# EAGLE design motor_driver_ver4.0 (EAGLE 6.2)
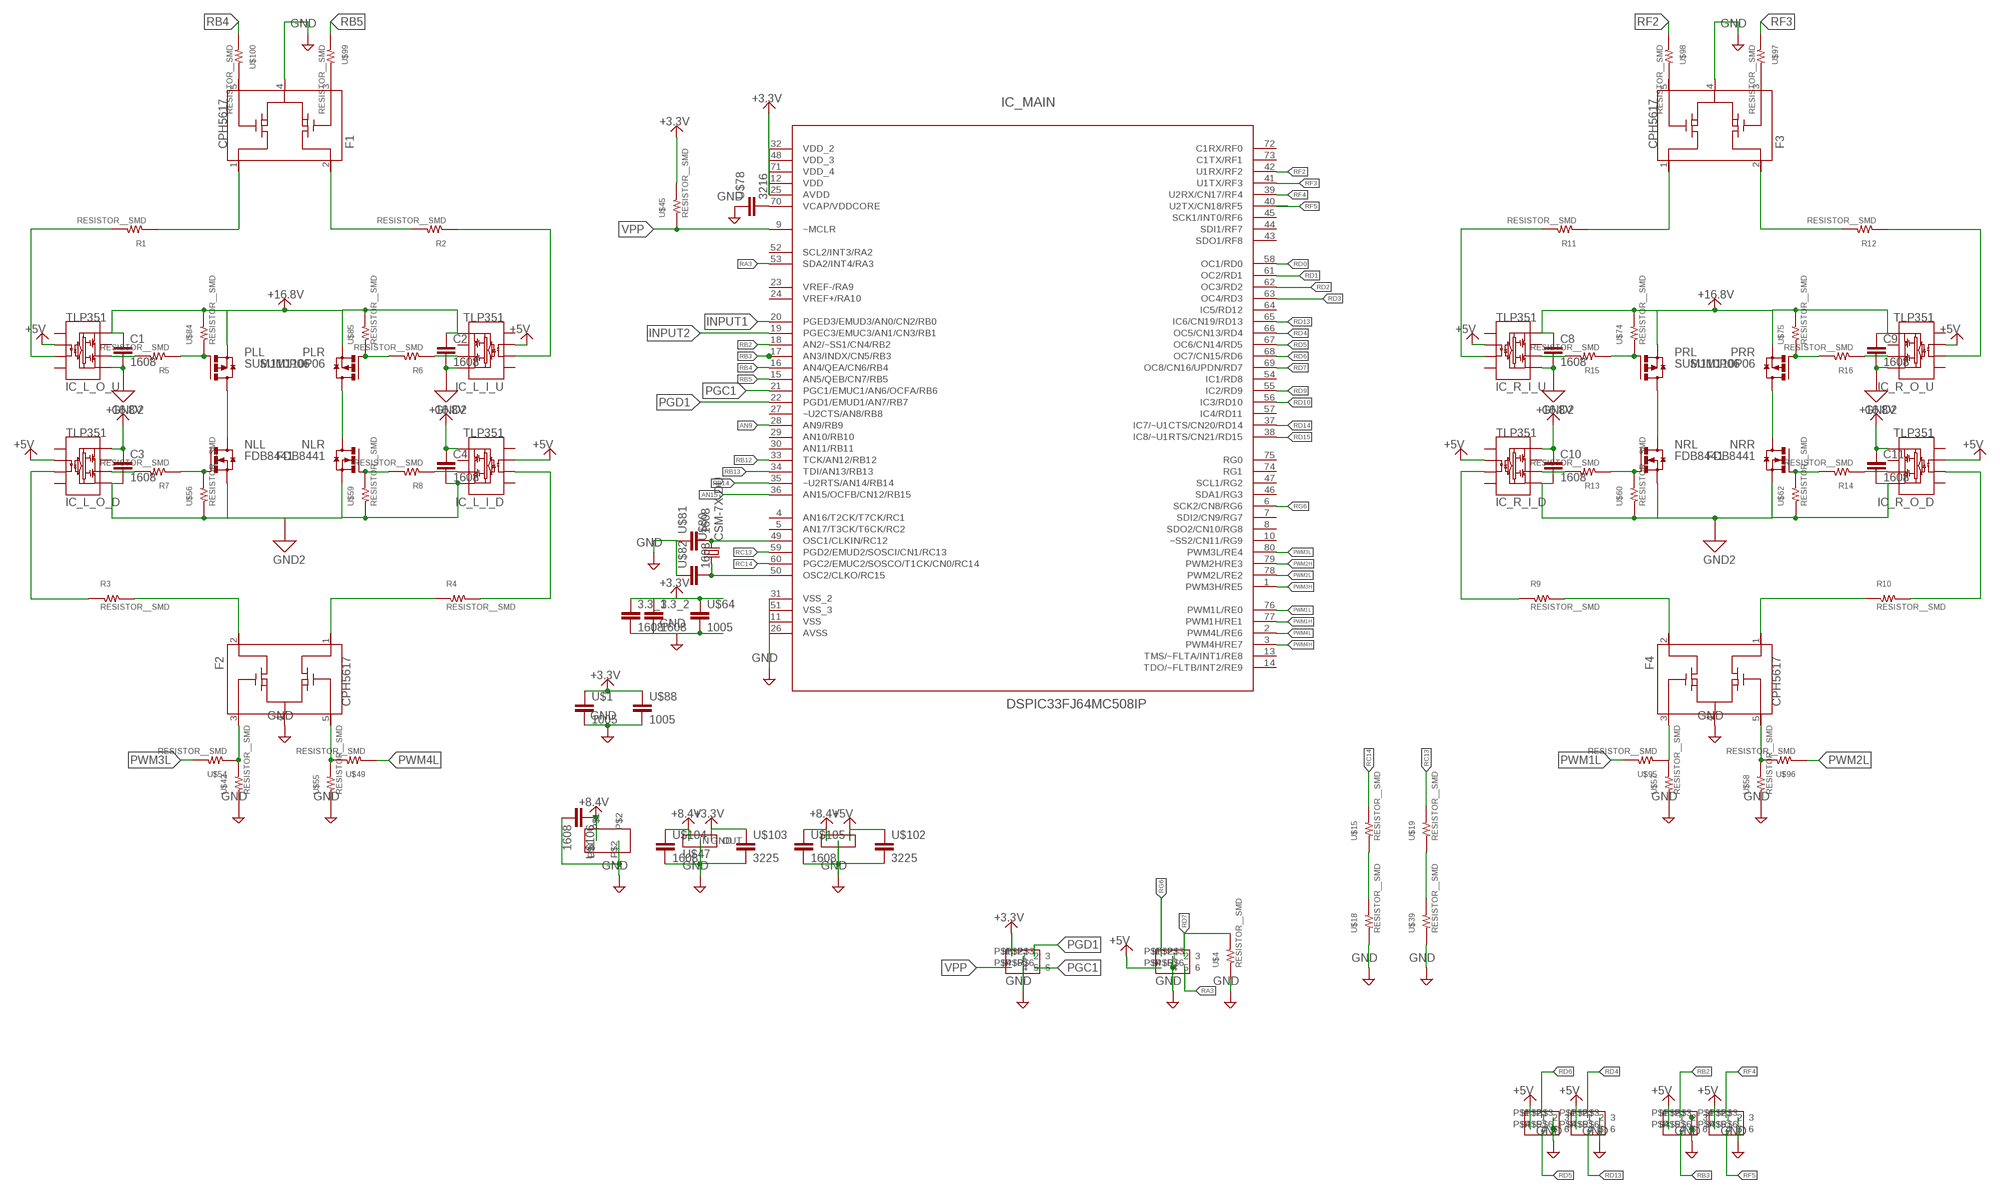
[diagram p0: schematic, sheet 1]

## Parts
3.3_1  1608  [1608]
3.3_2  1608  [1608]
C1  1608  [1608]
C2  1608  [1608]
C3  1608  [1608]
C4  1608  [1608]
C8  1608  [1608]
C9  1608  [1608]
C10  1608  [1608]
C11  1608  [1608]
F1  CPH5617  [CHP-5]
F2  CPH5617  [CHP-5]
F3  CPH5617  [CHP-5]
F4  CPH5617  [CHP-5]
IC_L_I_D  TLP351  [DIL08]
IC_L_I_U  TLP351  [DIL08]
IC_L_O_D  TLP351  [DIL08]
IC_L_O_U  TLP351  [DIL08]
IC_MAIN  DSPIC33FJ64MC508IP  [QFP50P1400X1400X120-80N]
IC_R_I_D  TLP351  [DIL08]
IC_R_I_U  TLP351  [DIL08]
IC_R_O_D  TLP351  [DIL08]
IC_R_O_U  TLP351  [DIL08]
NLL  FDB8441  [TO-263]
NLR  FDB8441  [TO-263]
NRL  FDB8441  [TO-263]
NRR  FDB8441  [TO-263]
PLL  SUM110P06  [TO-263]
PLR  SUM110P06  [TO-263]
PRL  SUM110P06  [TO-263]
PRR  SUM110P06  [TO-263]
R1  RESISTOR__SMD  [1608]
R2  RESISTOR__SMD  [1608]
R3  RESISTOR__SMD  [1608]
R4  RESISTOR__SMD  [1608]
R5  RESISTOR__SMD  [1608]
R6  RESISTOR__SMD  [1608]
R7  RESISTOR__SMD  [1608]
R8  RESISTOR__SMD  [1608]
R9  RESISTOR__SMD  [1608]
R10  RESISTOR__SMD  [1608]
R11  RESISTOR__SMD  [1608]
R12  RESISTOR__SMD  [1608]
R13  RESISTOR__SMD  [1608]
R14  RESISTOR__SMD  [1608]
R15  RESISTOR__SMD  [1608]
R16  RESISTOR__SMD  [1608]
RA3  PIN_HEADER_32  [PIN_HEADER_3*2]
U$1  1005  [1005]
U$4  RESISTOR__SMD  [1608]
U$5  PIN_HEADER_32  [PIN_HEADER_3*2]
U$15  RESISTOR__SMD  [1608]
U$18  RESISTOR__SMD  [1608]
U$19  RESISTOR__SMD  [1608]
U$20  PIN_HEADER_32  [PIN_HEADER_3*2]
U$39  RESISTOR__SMD  [1608]
U$42  RESISTOR__SMD  [1608]
U$45  RESISTOR__SMD  [1608]
U$47  TA48M033F  [ＴＡ４８]
U$49  RESISTOR__SMD  [1608]
U$51  PIN_HEADER_2  [PIN_HEADER_2S]
U$54  RESISTOR__SMD  [1608]
U$55  RESISTOR__SMD  [1608]
U$56  RESISTOR__SMD  [1608]
U$57  RESISTOR__SMD  [1608]
U$58  RESISTOR__SMD  [1608]
U$59  RESISTOR__SMD  [1608]
U$60  RESISTOR__SMD  [1608]
U$62  RESISTOR__SMD  [1608]
U$64  1005  [1005]
U$65  TA48M05F  [ＴＡ４８]
U$66  PIN_HEADER_32  [PIN_HEADER_3*2]
U$67  PIN_HEADER_32  [PIN_HEADER_3*2]
U$74  RESISTOR__SMD  [1608]
U$75  RESISTOR__SMD  [1608]
U$78  3216  [3216]
U$80  CSM-7X-DU  [CSM-7X-DU]
U$81  1608  [1608]
U$82  1608  [1608]
U$84  RESISTOR__SMD  [1608]
U$85  RESISTOR__SMD  [1608]
U$86  PIN_HEADER_32  [PIN_HEADER_3*2]
U$88  1005  [1005]
U$95  RESISTOR__SMD  [1608]
U$96  RESISTOR__SMD  [1608]
U$97  RESISTOR__SMD  [1608]
U$98  RESISTOR__SMD  [1608]
U$99  RESISTOR__SMD  [1608]
U$100  RESISTOR__SMD  [1608]
U$102  3225  [3225]
U$103  3225  [3225]
U$104  1608  [1608]
U$105  1608  [1608]
U$106  1608  [1608]

## Nets
+3.3V: 3.3_1.P$1 3.3_2.P$1 IC_MAIN.12(VDD) IC_MAIN.25(AVDD) IC_MAIN.32(VDD_2) IC_MAIN.48(VDD_3) IC_MAIN.71(VDD_4) U$1.1 U$45.2 U$47.3(OUT) U$64.1 U$86.P$1 U$88.1 U$103.P$1
+5V: IC_L_I_D.2(LED+) IC_L_I_U.2(LED+) IC_L_O_D.2(LED+) IC_L_O_U.2(LED+) IC_R_I_D.2(LED+) IC_R_I_U.2(LED+) IC_R_O_D.2(LED+) IC_R_O_U.2(LED+) RA3.P$4 U$5.P$1 U$5.P$4 U$20.P$1 U$20.P$4 U$65.3(OUT) U$66.P$1 U$66.P$4 U$67.P$1 U$67.P$4 U$102.P$1
+8.4V: U$47.1(IN) U$51.P$1 U$65.1(IN) U$104.P$1 U$105.P$1 U$106.P$1
+16.8V: C1.P$1 C2.P$1 C3.P$1 C4.P$1 C8.P$1 C9.P$1 C10.P$1 C11.P$1 IC_L_I_D.8(VDD) IC_L_I_U.8(VDD) IC_L_O_D.8(VDD) IC_L_O_U.8(VDD) IC_R_I_D.8(VDD) IC_R_I_U.8(VDD) IC_R_O_D.8(VDD) IC_R_O_U.8(VDD) PLL.2(S) PLR.2(S) PRL.2(S) PRR.2(S) U$74.2 U$75.2 U$84.2 U$85.2
AN9: IC_MAIN.28(AN9/RB9)
AN15: IC_MAIN.36(AN15/OCFB/CN12/RB15)
GND: 3.3_1.P$2 3.3_2.P$2 F1.4(S) F2.4(S) F3.4(S) F4.4(S) IC_MAIN.11(VSS) IC_MAIN.26(AVSS) IC_MAIN.31(VSS_2) IC_MAIN.51(VSS_3) RA3.P$2 RA3.P$5 U$1.2 U$4.1 U$5.P$3 U$5.P$6 U$18.1 U$20.P$3 U$20.P$6 U$39.1 U$42.1 U$47.2(GND) U$51.P$2 U$55.1 U$57.1 U$58.1 U$64.2 U$65.2(GND) U$66.P$3 U$66.P$6 U$67.P$3 U$67.P$6 U$78.P$1 U$81.P$1 U$82.P$1 U$86.P$2 U$86.P$5 U$88.2 U$102.P$2 U$103.P$2 U$104.P$2 U$105.P$2 U$106.P$2
GND2: C1.P$2 C2.P$2 C3.P$2 C4.P$2 C8.P$2 C9.P$2 C10.P$2 C11.P$2 IC_L_I_D.5(GND) IC_L_I_U.5(GND) IC_L_O_D.5(GND) IC_L_O_U.5(GND) IC_R_I_D.5(GND) IC_R_I_U.5(GND) IC_R_O_D.5(GND) IC_R_O_U.5(GND) NLL.2(S) NLR.2(S) NRL.2(S) NRR.2(S) U$56.1 U$59.1 U$60.1 U$62.1
INPUT1: IC_MAIN.20(PGED3/EMUD3/AN0/CN2/RB0)
INPUT2: IC_MAIN.19(PGEC3/EMUC3/AN1/CN3/RB1)
N$1: F2.1(D1) R4.1
N$2: F2.2(D2) R3.2
N$3: IC_L_O_D.3(LED-) R3.1
N$4: IC_L_I_D.3(LED-) R4.2
N$5: U$15.1 U$18.2
N$6: IC_MAIN.49(OSC1/CLKIN/RC12) U$80.2 U$81.P$2
N$7: F1.1(D1) R1.1
N$8: F1.2(D2) R2.2
N$9: NLL.1(G) R7.1 U$56.2
N$10: NLR.1(G) R8.2 U$59.2
N$11: IC_L_O_D.6(OUT) R7.2
N$12: NLL.3(D) PLL.3(D)
N$13: NLR.3(D) PLR.3(D)
N$14: IC_L_I_D.6(OUT) R8.1
N$15: PLL.1(G) R5.1 U$84.1
N$16: IC_L_O_U.6(OUT) R5.2
N$17: IC_L_O_U.3(LED-) R1.2
N$18: IC_L_I_U.3(LED-) R2.1
N$19: U$19.1 U$39.2
N$20: F1.5(G1) U$100.2
N$21: PLR.1(G) R6.2 U$85.1
N$22: IC_L_I_U.6(OUT) R6.1
N$23: NRL.3(D) PRL.3(D)
N$24: NRR.3(D) PRR.3(D)
N$25: IC_R_I_D.3(LED-) R9.1
N$26: IC_R_O_D.3(LED-) R10.2
N$27: F1.3(G2) U$99.2
N$28: F3.5(G1) U$98.2
N$29: IC_R_I_U.3(LED-) R11.2
N$30: IC_R_O_U.3(LED-) R12.1
N$31: F3.3(G2) U$97.2
N$32: IC_MAIN.50(OSC2/CLKO/RC15) U$80.1 U$82.P$2
N$33: F4.1(D1) R10.1
N$34: F4.2(D2) R9.2
N$35: F3.1(D1) R11.1
N$36: F3.2(D2) R12.2
N$37: NRL.1(G) R13.1 U$60.2
N$38: IC_R_I_D.6(OUT) R13.2
N$39: NRR.1(G) R14.2 U$62.2
N$40: IC_R_O_D.6(OUT) R14.1
N$41: PRL.1(G) R15.1 U$74.1
N$42: IC_R_I_U.6(OUT) R15.2
N$43: PRR.1(G) R16.2 U$75.1
N$44: IC_R_O_U.6(OUT) R16.1
N$45: IC_MAIN.70(VCAP/VDDCORE) U$78.P$2
PGC1: IC_MAIN.21(PGC1/EMUC1/AN6/OCFA/RB6) U$86.P$6
PGD1: IC_MAIN.22(PGD1/EMUD1/AN7/RB7) U$86.P$3
PWM1H: IC_MAIN.77(PWM1H/RE1)
PWM1L: IC_MAIN.76(PWM1L/RE0) U$95.2
PWM1L_S: F4.3(G2) U$57.2 U$95.1
PWM2H: IC_MAIN.79(PWM2H/RE3)
PWM2L: IC_MAIN.78(PWM2L/RE2) U$96.1
PWM2L_S: F4.5(G1) U$58.2 U$96.2
PWM3H: IC_MAIN.1(PWM3H/RE5)
PWM3L: IC_MAIN.80(PWM3L/RE4) U$54.2
PWM3L_S: F2.3(G2) U$42.2 U$54.1
PWM4H: IC_MAIN.3(PWM4H/RE7)
PWM4L: IC_MAIN.2(PWM4L/RE6) U$49.1
PWM4L_S: F2.5(G1) U$49.2 U$55.2
RA3: IC_MAIN.53(SDA2/INT4/RA3) RA3.P$6
RB2: IC_MAIN.18(AN2/~SS1/CN4/RB2) U$5.P$2
RB3: IC_MAIN.17(AN3/INDX/CN5/RB3) U$5.P$5
RB4: IC_MAIN.16(AN4/QEA/CN6/RB4) U$100.1
RB5: IC_MAIN.15(AN5/QEB/CN7/RB5) U$99.1
RB12: IC_MAIN.33(TCK/AN12/RB12)
RB13: IC_MAIN.34(TDI/AN13/RB13)
RB14: IC_MAIN.35(~U2RTS/AN14/RB14)
RC13: IC_MAIN.59(PGD2/EMUD2/SOSCI/CN1/RC13) U$19.2
RC14: IC_MAIN.60(PGC2/EMUC2/SOSCO/T1CK/CN0/RC14) U$15.2
RD0: IC_MAIN.58(OC1/RD0)
RD1: IC_MAIN.61(OC2/RD1)
RD2: IC_MAIN.62(OC3/RD2)
RD3: IC_MAIN.63(OC4/RD3)
RD4: IC_MAIN.66(OC5/CN13/RD4) U$67.P$2
RD5: IC_MAIN.67(OC6/CN14/RD5) U$66.P$5
RD6: IC_MAIN.68(OC7/CN15/RD6) U$66.P$2
RD7: IC_MAIN.69(OC8/CN16/UPDN/RD7) RA3.P$3 U$4.2
RD9: IC_MAIN.55(IC2/RD9)
RD10: IC_MAIN.56(IC3/RD10)
RD13: IC_MAIN.65(IC6/CN19/RD13) U$67.P$5
RD14: IC_MAIN.37(IC7/~U1CTS/CN20/RD14)
RD15: IC_MAIN.38(IC8/~U1RTS/CN21/RD15)
RF2: IC_MAIN.42(U1RX/RF2) U$98.1
RF3: IC_MAIN.41(U1TX/RF3) U$97.1
RF4: IC_MAIN.39(U2RX/CN17/RF4) U$20.P$2
RF5: IC_MAIN.40(U2TX/CN18/RF5) U$20.P$5
RG6: IC_MAIN.6(SCK2/CN8/RG6) RA3.P$1
VPP: IC_MAIN.9(~MCLR) U$45.1 U$86.P$4
Unconnected: IC_L_I_D.1(NC1) IC_L_I_D.4(NC4) IC_L_I_D.7(NC7) IC_L_I_U.1(NC1) IC_L_I_U.4(NC4) IC_L_I_U.7(NC7) IC_L_O_D.1(NC1) IC_L_O_D.4(NC4) IC_L_O_D.7(NC7) IC_L_O_U.1(NC1) IC_L_O_U.4(NC4) IC_L_O_U.7(NC7) IC_MAIN.4(AN16/T2CK/T7CK/RC1) IC_MAIN.5(AN17/T3CK/T6CK/RC2) IC_MAIN.7(SDI2/CN9/RG7) IC_MAIN.8(SDO2/CN10/RG8) IC_MAIN.10(~SS2/CN11/RG9) IC_MAIN.13(TMS/~FLTA/INT1/RE8) IC_MAIN.14(TDO/~FLTB/INT2/RE9) IC_MAIN.23(VREF-/RA9) IC_MAIN.24(VREF+/RA10) IC_MAIN.27(~U2CTS/AN8/RB8) IC_MAIN.29(AN10/RB10) IC_MAIN.30(AN11/RB11) IC_MAIN.43(SDO1/RF8) IC_MAIN.44(SDI1/RF7) IC_MAIN.45(SCK1/INT0/RF6) IC_MAIN.46(SDA1/RG3) IC_MAIN.47(SCL1/RG2) IC_MAIN.52(SCL2/INT3/RA2) IC_MAIN.54(IC1/RD8) IC_MAIN.57(IC4/RD11) IC_MAIN.64(IC5/RD12) IC_MAIN.72(C1RX/RF0) IC_MAIN.73(C1TX/RF1) IC_MAIN.74(RG1) IC_MAIN.75(RG0) IC_R_I_D.1(NC1) IC_R_I_D.4(NC4) IC_R_I_D.7(NC7) IC_R_I_U.1(NC1) IC_R_I_U.4(NC4) IC_R_I_U.7(NC7) IC_R_O_D.1(NC1) IC_R_O_D.4(NC4) IC_R_O_D.7(NC7) IC_R_O_U.1(NC1) IC_R_O_U.4(NC4) IC_R_O_U.7(NC7)

## Library data of the parts
3.3_1 3.3_2 C1-C4 C8-C11 U$81 U$82 U$104-U$106 = 02_C:1608
F1-F4 = 06_FET:CPH5617
IC_L_I_D IC_L_I_U IC_L_O_D IC_L_O_U IC_R_I_D IC_R_I_U IC_R_O_D IC_R_O_U = 04_IC:TLP351
IC_MAIN = 07_PIC:DSPIC33FJ64MC508IP
NLL NLR NRL NRR = 06_FET:FDB8441
PLL PLR PRL PRR = 06_FET:SUM110P06
R1-R16 U$4 U$15 U$18 U$19 U$39 U$42 U$45 U$49 U$54-U$60 U$62 U$74 U$75 U$84 U$85 U$95-U$100 = 01_R:RESISTOR__SMD
RA3 U$5 U$20 U$66 U$67 U$86 = 08_CONECTOR:PIN_HEADER_3*2
U$1 U$64 U$88 = 02_C:1005
U$47 = 04_IC:TA48M033F
U$51 = 08_CONECTOR:PIN_HEADER_2
U$65 = 04_IC:TA48M05F
U$78 = 02_C:3216
U$80 = CRYSTAL:CSM-7X-DU: SMD CRYSTAL Source: www.ecsxtal.com .. Crystal 3.6864MHz CSM_7X_DU.PDF; OC_FARNELL: unknown; OC_NEWARK: unknown
U$102 U$103 = 02_C:3225

## Board
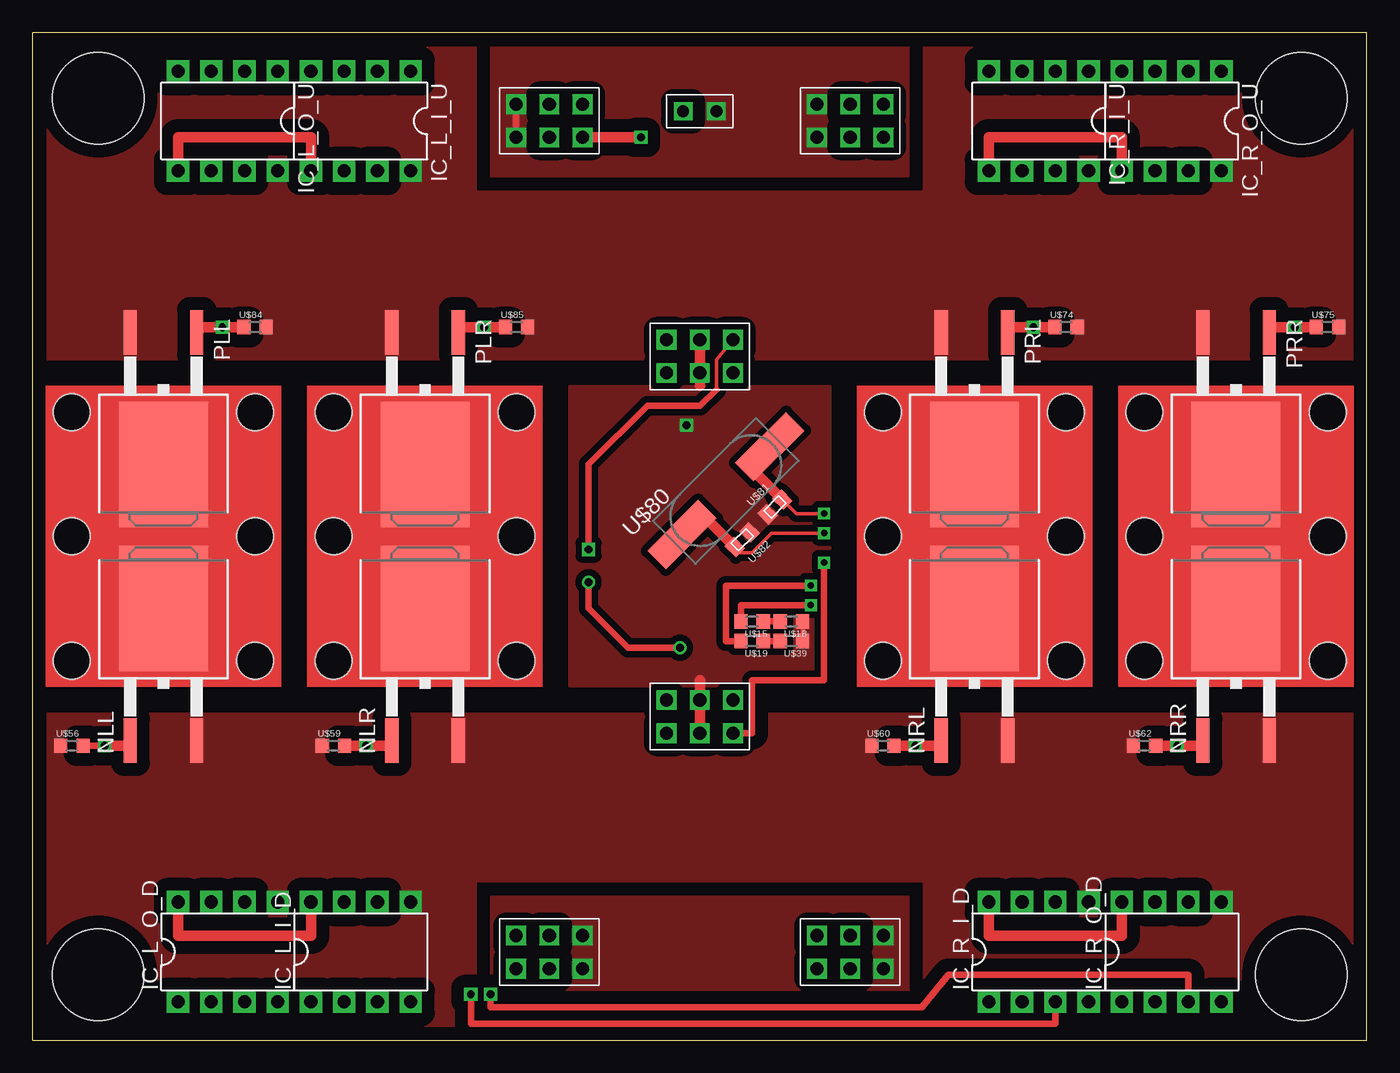
[diagram p1: board, top side]
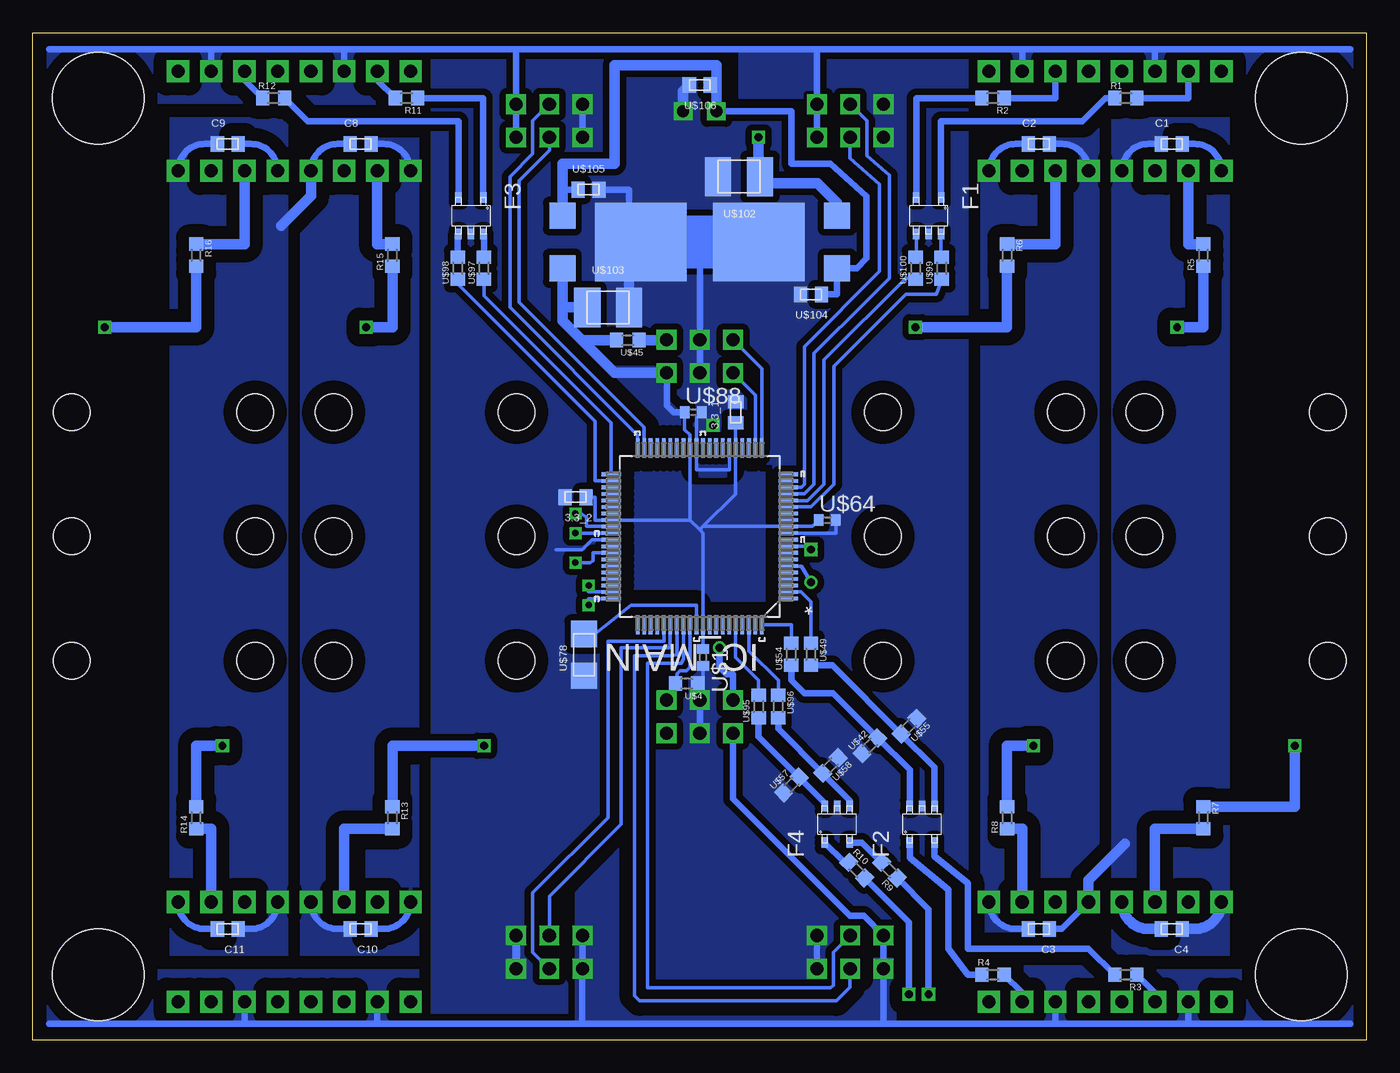
[diagram p2: board, bottom side, seen from below]

Size 102 x 77 mm. Coordinates in mm from the lower left corner, seen from the top.
Outline: 0,0 102,0 102,77 0,77 0,0
Copper layers (1*16): Top 0.035mm / dielectric 1.5mm / Bottom 0.035mm
Design rules: minimum track width 10mil, minimum drill 24mil, track to track 8mil, track to pad 8mil, pad to pad 8mil, via to via 8mil, smd to smd 8mil, copper to edge 40mil, drill to drill 8mil, minimum pad ring 10mil, minimum via ring 8mil, stop-mask expansion 4mil, vias tented up to drill 0mil, thermal gap 10mil
Holes 2.8 mm at 3,38.5 3,48 17,48 17,38.5 3,29 17,29 23,38.5 23,29 23,48 37,48 37,38.5 37,29 65,38.5 79,38.5 85,38.5 99,38.5 65,48 79,48 85,48 99,48 65,29 79,29 85,29 99,29
Holes 7 mm at 5,5 5,72 97,5 97,72

### Footprints (pad centres in the part's own frame; a part is rotated, then mirrored left to right if it is on the bottom)
1608 = smd 1 x 1.2: P$1 -0.8,0; P$2 0.8,0
CHP-5 = smd 0.5 x 0.8: 1 -0.95,-1.4; 2 0.95,-1.4; 3 -0.95,1.4; 4 0,1.4; 5 0.95,1.4
DIL08 = drill 1 pad 1.7 square: 1 -3.81,-3.81; 2 -1.27,-3.81; 3 1.27,-3.81; 4 3.81,-3.81; 5 3.81,3.81; 6 1.27,3.81; 7 -1.27,3.81; 8 -3.81,3.81
QFP50P1400X1400X120-80N = smd 1.473 x 0.279: 1 -6.756,4.75; 2 -6.756,4.242; 3 -6.756,3.759; 4 -6.756,3.251; 5 -6.756,2.743; 6 -6.756,2.261; 7 -6.756,1.753; 8 -6.756,1.245; 9 -6.756,0.762; 10 -6.756,0.254; 11 -6.756,-0.254; 12 -6.756,-0.762; 13 -6.756,-1.245; 14 -6.756,-1.753; 15 -6.756,-2.261; 16 -6.756,-2.743; 17 -6.756,-3.251; 18 -6.756,-3.759; 19 -6.756,-4.242; 20 -6.756,-4.75; 41 6.756,-4.75; 42 6.756,-4.242; 43 6.756,-3.759; 44 6.756,-3.251; 45 6.756,-2.743; 46 6.756,-2.261; 47 6.756,-1.753; 48 6.756,-1.245; 49 6.756,-0.762; 50 6.756,-0.254; 51 6.756,0.254; 52 6.756,0.762; 53 6.756,1.245; 54 6.756,1.753; 55 6.756,2.261; 56 6.756,2.743; 57 6.756,3.251; 58 6.756,3.759; 59 6.756,4.242; 60 6.756,4.75 | smd 0.279 x 1.473: 21 -4.75,-6.756; 22 -4.242,-6.756; 23 -3.759,-6.756; 24 -3.251,-6.756; 25 -2.743,-6.756; 26 -2.261,-6.756; 27 -1.753,-6.756; 28 -1.245,-6.756; 29 -0.762,-6.756; 30 -0.254,-6.756; 31 0.254,-6.756; 32 0.762,-6.756; 33 1.245,-6.756; 34 1.753,-6.756; 35 2.261,-6.756; 36 2.743,-6.756; 37 3.251,-6.756; 38 3.759,-6.756; 39 4.242,-6.756; 40 4.75,-6.756; 61 4.75,6.756; 62 4.242,6.756; 63 3.759,6.756; 64 3.251,6.756; 65 2.743,6.756; 66 2.261,6.756; 67 1.753,6.756; 68 1.245,6.756; 69 0.762,6.756; 70 0.254,6.756; 71 -0.254,6.756; 72 -0.762,6.756; 73 -1.245,6.756; 74 -1.753,6.756; 75 -2.261,6.756; 76 -2.743,6.756; 77 -3.251,6.756; 78 -3.759,6.756; 79 -4.242,6.756; 80 -4.75,6.756
TO-263 = smd 1 x 3.4: 1 -2.54,-6.6; 2 2.54,-6.6 | smd 6.8 x 9.6: 3 0,3.5
1608' = smd 1 x 1.1: 1 -0.85,0; 2 0.85,0
PIN_HEADER_3*2 = drill 1 pad 1.5 square: P$1 -2.54,0; P$2 0,0; P$3 2.54,0; P$4 -2.54,-2.54; P$5 0,-2.54; P$6 2.54,-2.54
1005 = smd 0.7 x 0.9: 1 -0.65,0; 2 0.65,0
ＴＡ４８ = smd 2 x 2: 1 -2,-3; 3 2,-3 | smd 6 x 7: 2 0,3
PIN_HEADER_2S = drill 0.9 square: P$1 -1.27,0; P$2 1.27,0
3216 = smd 2 x 2: P$1 -1.6,0; P$2 1.6,0
CSM-7X-DU = smd 5.5 x 2: 1 -4.75,0; 2 4.75,0
3225 = smd 2 x 3: P$1 -1.6,0; P$2 1.6,0

### Placement (x,y rotation side)
3.3_1  48.25,48 90 bottom
3.3_2  60.5,41.5 180 bottom
C1  14.92,68.5 0 bottom
C2  25.08,68.5 0 bottom
C3  25.08,8.5 180 bottom
C4  14.92,8.5 180 bottom
C8  76.92,68.5 0 bottom
C9  87.08,68.5 0 bottom
C10  76.92,8.5 180 bottom
C11  87.08,8.5 180 bottom
F1  33.5,63 180 bottom
F2  34,16.5 0 bottom
F3  68.5,63 180 bottom
F4  40.5,16.5 0 bottom
IC_L_I_D  25.08,6.75 0 top
IC_L_I_U  25.08,70.25 180 top
IC_L_O_D  14.92,6.75 0 top
IC_L_O_U  14.92,70.25 180 top
IC_MAIN  51,38.5 180 bottom
IC_R_I_D  76.92,6.75 0 top
IC_R_I_U  76.92,70.25 180 top
IC_R_O_D  87.08,6.75 0 top
IC_R_O_U  87.08,70.25 180 top
NLL  10,29.5 0 top
NLR  30,29.5 0 top
NRL  72,29.5 0 top
NRR  92,29.5 0 top
PLL  10,47.5 180 top
PLR  30,47.5 180 top
PRL  72,47.5 180 top
PRR  92,47.5 180 top
R1  RESISTOR__SMD  [1608']  18.42,72 0 bottom
R2  RESISTOR__SMD  [1608']  28.58,72 180 bottom
R3  RESISTOR__SMD  [1608']  18.42,5 180 bottom
R4  RESISTOR__SMD  [1608']  28.58,5 0 bottom
R5  RESISTOR__SMD  [1608']  12.5,60 90 bottom
R6  RESISTOR__SMD  [1608']  27.5,60 270 bottom
R7  RESISTOR__SMD  [1608']  12.5,17 270 bottom
R8  RESISTOR__SMD  [1608']  27.5,17 90 bottom
R9  RESISTOR__SMD  [1608']  36.5,13 135 bottom
R10  RESISTOR__SMD  [1608']  39,13 315 bottom
R11  RESISTOR__SMD  [1608']  73.42,72 180 bottom
R12  RESISTOR__SMD  [1608']  83.58,72 0 bottom
R13  RESISTOR__SMD  [1608']  74.5,17 270 bottom
R14  RESISTOR__SMD  [1608']  89.5,17 90 bottom
R15  RESISTOR__SMD  [1608']  74.5,60 90 bottom
R16  RESISTOR__SMD  [1608']  89.5,60 270 bottom
RA3  51,26 0 top
U$1  50.75,29.25 270 bottom
U$4  RESISTOR__SMD  [1608']  52,27.25 180 bottom
U$5  39.5,69 180 top
U$15  RESISTOR__SMD  [1608']  55,32 180 top
U$18  RESISTOR__SMD  [1608']  58,32 180 top
U$19  RESISTOR__SMD  [1608']  55,30.5 180 top
U$20  62.5,69 180 top
U$39  RESISTOR__SMD  [1608']  58,30.5 180 top
U$42  RESISTOR__SMD  [1608']  38,22.5 45 bottom
U$45  RESISTOR__SMD  [1608']  56.5,53.5 180 bottom
U$47  58.5,61 270 bottom
U$49  RESISTOR__SMD  [1608']  42.5,29.5 270 bottom
U$51  51,71 0 top
U$54  RESISTOR__SMD  [1608']  44,29.5 90 bottom
U$55  RESISTOR__SMD  [1608']  35,24 225 bottom
U$56  RESISTOR__SMD  [1608']  3,22.5 0 top
U$57  RESISTOR__SMD  [1608']  44,19.5 45 bottom
U$58  RESISTOR__SMD  [1608']  41,21 225 bottom
U$59  RESISTOR__SMD  [1608']  23,22.5 0 top
U$60  RESISTOR__SMD  [1608']  65,22.5 0 top
U$62  RESISTOR__SMD  [1608']  85,22.5 0 top
U$64  41.25,39.75 0 bottom
U$65  43.5,61 90 bottom
U$66  39.5,8 0 top
U$67  62.5,8 0 top
U$74  RESISTOR__SMD  [1608']  79,54.5 0 top
U$75  RESISTOR__SMD  [1608']  99,54.5 0 top
U$78  59.85,29.45 90 bottom
U$80  53,42 45 top
U$81  56.75,40.75 45 top
U$82  54.25,38.25 225 top
U$84  RESISTOR__SMD  [1608']  17,54.5 0 top
U$85  RESISTOR__SMD  [1608']  37,54.5 0 top
U$86  51,51 180 top
U$88  51.5,48 0 bottom
U$95  RESISTOR__SMD  [1608']  46.5,25.5 90 bottom
U$96  RESISTOR__SMD  [1608']  45,25.5 270 bottom
U$97  RESISTOR__SMD  [1608']  67.5,59 90 bottom
U$98  RESISTOR__SMD  [1608']  69.5,59 90 bottom
U$99  RESISTOR__SMD  [1608']  32.5,59 90 bottom
U$100  RESISTOR__SMD  [1608']  34.5,59 90 bottom
U$102  48,66 180 bottom
U$103  58,56 0 bottom
U$104  42.5,57 180 bottom
U$105  59.5,65 0 bottom
U$106  51,73 180 bottom

### Tracks (layer width: path | path; a pad name or v marks a point on that pad's centre or on a via)
+3.3V
  Bottom 0.28: 3.3_2.P$1 59,41.5 59,39.74 IC_MAIN.48 51.74,39.74 | U$1.1 IC_MAIN.71 50.75,38.75 51,39 | 51.74,39.74 51,39 | 51.74,39.74 51.76,39.76 IC_MAIN.32 51.76,46.26 52.15,46.65 U$88.1 | 50.74,39.26 48.26,41.74 IC_MAIN.25 3.3_1.P$1 | 50.74,39.26 IC_MAIN.12 42.39,39.26 U$64.1 | 50.74,39.26 51,39
  Bottom 0.5: U$88.1 53,48 53.5,48.5 53.5,50.96 U$86.P$1
  Bottom 0.8: U$86.P$1 57.5,51 60,53.5 | 60,53.5 61.5,55 61.5,56 | 61.5,56 U$47.3 | U$45.2 60,53.5 | U$103.P$1 61.5,56
  pour Bottom (isolate 1): 46,43.5 56,43.5 56,33.5 46,33.5
  pour Bottom (isolate 1, no thermals): 52,46.5 54.5,46.5 54.5,47.5 58.5,51.5 54.5,51.5 53.5,50.5 53.5,49 52.5,48 52.5,47.5 52,47
+5V  (via drill 0.6)
  Top 0.8: U$5.P$1 v46.5,69
  Bottom 0.5: U$5.P$1 U$5.P$4 42.04,75.75 | U$20.P$1 U$20.P$4 65.04,75.75 | 1.25,1.25 13.65,1.25 | 13.65,1.25 23.81,1.25 | 23.81,1.25 37,1.25 | 37,1.25 60,1.25 | 75.65,1.25 85.81,1.25 | 85.81,1.25 100.75,1.25 | 1.25,75.75 16.19,75.75 | 16.19,75.75 26.35,75.75 | 26.35,75.75 42.04,75.75 | 42.04,75.75 65.04,75.75 | 65.04,75.75 78.19,75.75 | 78.19,75.75 88.35,75.75 | 88.35,75.75 100.75,75.75 | IC_L_O_D.2 13.65,1.25 | IC_L_I_D.2 23.81,1.25 | IC_R_I_D.2 75.65,1.25 | IC_R_O_D.2 85.81,1.25 | IC_L_O_U.2 16.19,75.75 | IC_L_I_U.2 26.35,75.75 | IC_R_I_U.2 78.19,75.75 | IC_R_O_U.2 88.35,75.75 | 37,1.25 36.96,1.29 U$66.P$4 U$66.P$1 38.46,9.5 39.5,9.5 48.46,18.46 RA3.P$4 | U$67.P$1 U$67.P$4 60,5.42 | 60,5.46 60,5.42 | 75.65,1.25 60,1.25 | 60,1.25 60,5.42
  Bottom 0.8: U$65.3 40.5,64 42,65.5 45.9,65.5 U$102.P$1 46.5,66.1 v46.5,69
  pour Bottom (isolate 1, rank 2, no thermals): 1,76 1,1 29.5,1 29.5,76
  pour Bottom (isolate 1, rank 2, no thermals): 101,1 72.5,1 72.5,76 101,76
  pour Bottom: 42,76 48,76 48,72 42,72
  pour Bottom (isolate 1, no thermals): 60.5,1.5 56.5,1.5 56.5,16.25 60.5,12.25
  pour Bottom (isolate 1, no thermals): 36,6.25 38.5,6.25 42,2.75 57.25,2.75 57.25,1.25 36,1.25
+8.4V
  Bottom 0.5: U$51.P$1 44,71 44,67 41,67 38.25,64.5 38.25,59.75 39,59 U$65.1 40.5,57 U$104.P$1 | U$105.P$1 61.5,65
  Bottom 0.8: U$106.P$1 49.73,72.53 U$51.P$1 49.73,74.5 57.5,74.5 57.5,67 61.5,67 61.5,65 U$47.1
+16.8V
  Top 0.8: IC_L_O_D.8 11.11,8 21.27,8 IC_L_I_D.8 | IC_R_I_D.8 73.11,8 83.27,8 IC_R_O_D.8
  Bottom 0.5: C3.P$1 23.33,8.5 IC_L_I_D.8 | C10.P$1 75.17,8.5 arc-90 IC_R_I_D.8 | C11.P$1 85.33,8.5 arc-90 IC_R_O_D.8 | C8.P$1 78.67,68.5 arc-90 IC_R_I_U.8 | C9.P$1 88.83,68.5 arc-90 IC_R_O_U.8 | C1.P$1 16.67,68.5 arc-90 IC_L_O_U.8 | C2.P$1 26.83,68.5 arc-90 IC_L_I_U.8
  Bottom 0.8: C4.P$1 13.17,8.5 arc-90 IC_L_O_D.8 | IC_L_I_D.8 21.27,12.23 18.5,15 | IC_R_I_U.8 80.73,64.52 83,62.25
  pour Bottom (isolate 1, no thermals): 19.5,6.5 10.5,6.5 10.5,70.5 19.5,70.5
  pour Bottom (isolate 1, no thermals): 82.5,70.5 91.5,70.5 91.5,6.5 82.5,6.5
  pour Top (isolate 1, rank 2, no thermals): 1,76 101,76 101,52 1,52
  pour Bottom (isolate 1): 72.5,21.5 72.5,10 74.5,10 76.5,12 76.5,14.5 74,14.5 73.5,15 73.5,21.5
  pour Bottom (isolate 1, no thermals): 29.5,55.5 28.5,55.5 28.5,62 25,62 25,62.5 25,66.5 29.5,66.5
GND  (via drill 0.6)
  Top 0.3: U$18.1 U$39.1
  Top 0.5: U$5.P$3 U$5.P$6
  Top 0.8: 51,53.5 U$86.P$2 51,50 | 51,23.5 RA3.P$2 51,27.5
  Bottom 0.28: IC_MAIN.26 48.74,43.6 51.25,43.6 IC_MAIN.31 51.25,47.6 U$88.2 | U$1.2 50.75,27.65 U$4.1 | IC_MAIN.11 40.6,38.75 U$64.2 | IC_MAIN.51 59.25,38.25 60,37.5 62,37.5
  Bottom 0.5: U$86.P$2 U$86.P$5 51,60.5 | 51,60.5 51,61 U$65.2 | U$20.P$6 U$20.P$3 | 51,60.5 52.27,61.77 53.23,61.77 U$47.2 | U$66.P$6 U$66.P$3 | RA3.P$5 RA3.P$2 51,27.1 U$4.1 | U$105.P$2 56.4,65 56.4,60
  Bottom 0.6: U$67.P$3 U$67.P$6
  Bottom 0.8: U$103.P$2 56.4,60 56.4,60.1 U$47.2 | U$106.P$2 52.27,72.53 U$51.P$2
  other vias: 50,47
  pour Bottom (isolate 0.5, rank 2, no thermals): 30.5,76 71.5,76 71.5,1 30.5,1
  pour Top (isolate 0.5, no thermals): 41,50 61,50 61,27 41,27
  pour Top (isolate 1, no thermals): 35,11 67,11 67,1 35,1
  pour Top (isolate 1, no thermals): 35,76 67,76 67,66 35,66
GND2
  Top 0.8: IC_L_I_U.5 21.27,69 11.11,69 IC_L_O_U.5 | IC_R_O_U.5 83.27,69 73.11,69 IC_R_I_U.5
  Bottom 0.5: C3.P$2 26.83,8.5 arc90 IC_L_I_D.5 | C10.P$2 78.67,8.5 arc90 IC_R_I_D.5 | C11.P$2 88.83,8.5 arc90 IC_R_O_D.5 | C8.P$2 75.17,68.5 arc90 IC_R_I_U.5 | C9.P$2 85.33,68.5 arc90 IC_R_O_U.5 | C1.P$2 13.17,68.5 arc90 IC_L_O_U.5 | C2.P$2 23.33,68.5 arc90 IC_L_I_U.5
  Bottom 0.8: C4.P$2 16.67,8.5 arc90 IC_L_O_D.5
  pour Top (isolate 1, rank 2, no thermals): 1,1 101,1 101,25 1,25
  pour Bottom (isolate 1, no thermals): 20.5,6.5 29.5,6.5 29.5,70.5 20.5,70.5
  pour Bottom (isolate 1, no thermals): 72.5,70.5 81.5,70.5 81.5,6.5 72.5,6.5
N$1
  Bottom 0.5: F2.1 34.95,13.95 32,11.5 32,7 30.5,5 R4.1
N$2
  Bottom 0.5: F2.2 33.05,14.05 30.5,12 30.5,7 21.27,7 R3.2
N$3
  Bottom 0.5: R3.1 16.19,3.62 IC_L_O_D.3
N$4
  Bottom 0.5: R4.2 26.35,3.62 IC_L_I_D.3
N$5
  Top 0.5: U$18.2 U$15.1
N$6  (via drill 0.5)
  Top 0.28: U$81.P$2 58.38,40.25 v60.5,40.25
  Top 0.8: U$81.P$2 55,43.63 55,44 U$80.2
  Bottom 0.28: v60.5,40.25 60,40.2 59.66,39.96 59.66,39.26 IC_MAIN.49
N$7
  Bottom 0.5: R1.1 20,72 21.75,70.25 32.55,70.25 F1.1
N$8
  Bottom 0.5: R2.2 34.45,72 F1.2
N$9  (via drill 0.6)
  Top 0.5: NLL.1 7.06,22.5 v5.5,22.5 U$56.2
  Top 0.8: v5.5,22.5 7.46,22.5 NLL.1
  Bottom 0.8: R7.1 5.5,17.85 v5.5,22.5
N$10  (via drill 0.6)
  Top 0.8: 27.06,22.5 v25.5,22.5 U$59.2 | 27.06,22.5 arc90 NLR.1 27.06,22.5
  Bottom 0.8: R8.2 27.5,22.5 v25.5,22.5
N$11
  Bottom 0.8: R7.2 16.19,16.15 IC_L_O_D.6
N$12
  Top 0.254: PLL.3 NLL.3
N$13
  Top 0.254: PLR.3 NLR.3
N$14
  Bottom 0.8: IC_L_I_D.6 26.35,16.15 R8.1
N$15  (via drill 0.6)
  Top 0.8: U$84.1 v14.5,54.5 12.54,54.5 PLL.1
  Bottom 0.8: R5.1 12.5,54.5 v14.5,54.5
N$16
  Bottom 0.8: IC_L_O_U.6 13.65,60.85 R5.2
N$17
  Bottom 0.5: R1.2 13.65,72 IC_L_O_U.3
N$18
  Bottom 0.5: R2.1 23.81,72 IC_L_I_U.3
N$19
  Top 0.5: U$19.1 U$39.2
N$20
  Bottom 0.28: F1.5 34.45,59.9 U$100.2
N$21  (via drill 0.6)
  Top 0.8: U$85.1 v34.5,54.5 32.54,54.5 PLR.1
  Bottom 0.8: R6.2 27.5,54.5 v34.5,54.5
N$22
  Bottom 0.8: IC_L_I_U.6 23.81,60.85 R6.1
N$23
  Top 0.254: PRL.3 NRL.3
N$24
  Top 0.254: PRR.3 NRR.3
N$25  (via drill 0.6 pad 1)
  Top 0.5: v33.5,3.5 33.5,1.25 78.19,1.25 IC_R_I_D.3
  Bottom 0.5: R9.1 33.5,10 v33.5,3.5
N$26  (via drill 0.6 pad 1)
  Top 0.5: IC_R_O_D.3 88.35,5 70,5 68,2.5 35,2.5 v35,3.5
  Bottom 0.5: R10.2 35,9 v35,3.5
N$27
  Bottom 0.28: F1.3 32.55,59.9 U$99.2
N$28
  Bottom 0.5: U$98.2 69.5,61.55 F3.5
N$29
  Bottom 0.5: R11.2 75.65,73.38 IC_R_I_U.3
N$30
  Bottom 0.5: R12.1 85.81,73.38 IC_R_O_U.3
N$31
  Bottom 0.5: U$97.2 67.5,61.55 F3.3
N$32  (via drill 0.5)
  Top 0.28: U$82.P$2 54.12,37.25 55,37.25 56.5,38.75 v60.5,38.75
  Top 0.8: U$82.P$2 51.37,40 51,40 U$80.1
  Bottom 0.28: v60.5,38.75 59.75,38.75 IC_MAIN.50
N$33
  Bottom 0.5: F4.1 39.95,13.6 R10.1
N$34
  Bottom 0.5: F4.2 38.6,15.1 R9.2
N$35
  Bottom 0.5: R11.1 67.55,72 F3.1
N$36
  Bottom 0.5: R12.2 80.98,70.25 69.45,70.25 F3.2
N$37  (via drill 0.6)
  Top 0.8: U$60.2 v67.5,22.5 69.46,22.5 NRL.1
  Bottom 0.8: R13.1 74.5,22.5 v67.5,22.5
N$38
  Bottom 0.8: IC_R_I_D.6 78.19,16.15 R13.2
N$39  (via drill 0.6)
  Top 0.8: U$62.2 v87.5,22.5 89.46,22.5 NRR.1
  Bottom 0.8: R14.2 89.5,22.5 v87.5,22.5
N$40
  Bottom 0.8: IC_R_O_D.6 88.35,16.15 R14.1
N$41  (via drill 0.6)
  Top 0.8: U$74.1 v76.5,54.5 74.54,54.5 PRL.1
  Bottom 0.8: R15.1 74.5,54.5 v76.5,54.5
N$42
  Bottom 0.8: IC_R_I_U.6 75.65,60.85 R15.2
N$43  (via drill 0.6)
  Top 0.8: 94.54,54.5 v96.5,54.5 U$75.1 | 94.5,54.5 94.54,54.5 | 94.54,54.5 PRR.1
  Bottom 0.8: R16.2 89.5,54.5 v96.5,54.5
N$44
  Bottom 0.8: IC_R_O_U.6 85.81,60.85 R16.1
N$45
  Bottom 0.28: IC_MAIN.70 51.25,33.25 56.25,33.25 58.3,31.6 59.1,31 U$78.P$2
N$46  (via drill 0.6)
  other vias: 14.5,54.5
N$47  (via drill 0.6)
  other vias: 34.5,54.5
N$48  (via drill 0.6)
  other vias: 76.5,54.5
N$49  (via drill 0.6)
  other vias: 96.5,54.5
N$50  (via drill 0.6)
  other vias: 87.5,22.5
N$51  (via drill 0.6)
  other vias: 67.5,22.5
N$52  (via drill 0.6)
  other vias: 25.5,22.5
N$53  (via drill 0.6)
  other vias: 5.5,22.5
N$56  (via drill 0.6)
  other vias: 5,72
N$57  (via drill 0.6)
  other vias: 97,72
N$58  (via drill 0.6)
  other vias: 23,38.5
N$59  (via drill 0.6)
  other vias: 5,5
N$60  (via drill 0.6 pad 0.41)
  other vias: 37,48
N$61  (via drill 0.6 pad 0.41)
  other vias: 37,29
N$62  (via drill 0.6 pad 0.41)
  other vias: 23,29
N$63  (via drill 0.6 pad 0.41)
  other vias: 23,48
N$64  (via drill 0.6 pad 0.41)
  other vias: 17,48
N$65  (via drill 0.6 pad 0.41)
  other vias: 17,29
N$66  (via drill 0.6 pad 0.41)
  other vias: 3,48
N$67  (via drill 0.6 pad 0.41)
  other vias: 3,29
N$68  (via drill 0.6 pad 0.41)
  other vias: 99,48
N$69  (via drill 0.6 pad 0.41)
  other vias: 99,29
N$70  (via drill 0.6 pad 0.41)
  other vias: 85,29
N$71  (via drill 0.6 pad 0.41)
  other vias: 85,48
N$72  (via drill 0.6 pad 0.41)
  other vias: 79,48
N$73  (via drill 0.6 pad 0.41)
  other vias: 79,29
N$74  (via drill 0.6 pad 0.41)
  other vias: 65,29
N$75  (via drill 0.6 pad 0.41)
  other vias: 65,48
N$76  (via drill 0.6 pad 0.41)
  other vias: 37,38.5
N$77  (via drill 0.6 pad 0.41)
  other vias: 65,38.5
N$78  (via drill 0.6 pad 0.41)
  other vias: 79,38.5
N$79  (via drill 0.6 pad 0.41)
  other vias: 85,38.5
N$80  (via drill 0.6 pad 0.41)
  other vias: 99,38.5
N$81  (via drill 0.6)
  other vias: 97,5
N$82  (via drill 0.6 pad 0.41)
  other vias: 17,38.5
N$83  (via drill 0.6 pad 0.41)
  other vias: 3,38.5
PGC1
  Bottom 0.28: IC_MAIN.21 46.25,51.33 U$86.P$6
PGD1
  Bottom 0.28: IC_MAIN.22 46.76,49.3 U$86.P$3
PWM1L
  Bottom 0.28: U$95.2 46.5,27.5 48.26,29.26 IC_MAIN.76
PWM1L_S
  Bottom 0.5: U$95.1 46.5,23.2 U$57.2 41.45,18.15 F4.3
PWM2L
  Bottom 0.28: U$96.1 45,27.5 47.24,29.74 IC_MAIN.78
PWM2L_S
  Bottom 0.5: U$96.2 45,23.8 U$58.2 39.55,18.35 F4.5
PWM3L
  Bottom 0.28: U$54.2 44,31.74 IC_MAIN.80
PWM3L_S
  Bottom 0.5: U$54.1 44,27.5 43,26.5 40.8,26.5 U$42.2 34.95,20.65 F2.3
PWM4L
  Bottom 0.28: IC_MAIN.2 43.26,34.26 42.5,33.5 U$49.1
PWM4L_S
  Bottom 0.5: U$49.2 40.85,28.65 U$55.2 33.05,20.85 F2.5
RA3  (via drill 0.5)
  Top 0.5: RA3.P$6 55,23.46 55,27.5 60.5,27.5 v60.5,36.5
  Bottom 0.28: v60.5,36.5 59.4,36.5 59.15,36.66 59.15,37.26 IC_MAIN.53
RB2
  Bottom 0.28: U$5.P$2 39.5,67.4 37.25,65.4 37.25,58.75 43,53 43,42.5 43.24,42.26 IC_MAIN.18
RB3
  Bottom 0.28: U$5.P$5 38.23,70.27 38.23,67.6 36.5,66.1 36.5,58.22 38.23,56.52 42.25,52.5 42.25,42.5 43,41.75 IC_MAIN.17
RB4
  Bottom 0.28: IC_MAIN.16 42.76,41.24 41.5,42.5 41.5,52 35.25,58.25 34.4,58.25 U$100.1
RB5
  Bottom 0.28: IC_MAIN.15 42.49,40.76 40.75,42.5 40.75,51.5 35.25,57 32.9,57 U$99.1
RC13  (via drill 0.5)
  Top 0.5: U$19.2 53,30.5 53,34.75 v59.5,34.75
  Bottom 0.28: v59.5,34.75 59.5,34.26 IC_MAIN.59
RC14  (via drill 0.5 pad 0.8)
  Top 0.5: U$15.2 54.15,33.25 v59.5,33.25
  Bottom 0.28: v59.5,33.25 59.5,33.75 IC_MAIN.60
RD4
  Bottom 0.28: IC_MAIN.66 53.26,30 57,30 57,16.5 62.5,11 U$67.P$2
RD5
  Bottom 0.28: U$66.P$5 39.5,4.05 40.55,3 55.6,3 56,3.4 56,29.4 53.2,29.4 52.75,29.45 IC_MAIN.67
RD6
  Bottom 0.28: U$66.P$2 40.77,6.73 40.77,4.2 41,4 55,4 55,28.8 52.4,28.8 52.24,29.16 IC_MAIN.68
RD7
  Bottom 0.28: IC_MAIN.69 51.76,28.49 52,28.25 52.5,28.25 52.75,28 52.75,27.35 U$4.2 52.85,26.69 RA3.P$3
RD13
  Bottom 0.28: IC_MAIN.65 53.74,30.5 58,30.5 58,17 63.77,11.25 63.77,6.73 U$67.P$5
RF2
  Bottom 0.28: IC_MAIN.42 59,42.74 59,47.3 69.5,57.8 U$98.1
RF3
  Bottom 0.254: U$97.1 67.5,56.9 57.8,47.2 57.8,43.25 IC_MAIN.41
RF4
  Bottom 0.28: U$20.P$2 62.5,68 64.8,65.7 64.8,56.4 55.24,46.84 IC_MAIN.39
RF5
  Bottom 0.28: U$20.P$5 63.77,70.27 63.77,67.73 65.5,66 65.5,56 55.75,46.25 IC_MAIN.40
RG6  (via drill 0.6)
  Top 0.5: v49.5,30 45.5,30 42.5,33 v42.5,35
  Bottom 0.28: v42.5,35 43.24,36.24 IC_MAIN.6
  Bottom 0.5: RA3.P$1 48.46,27.96 48.96,27.96 49.5,28.5 v49.5,30
VPP  (via drill 0.6)
  Top 0.28: 52.27,49.73 52.27,52 U$86.P$4
  Top 0.5: v42.5,37.5 42.5,44 47,48.5 51,48.5 52.27,49.73
  Bottom 0.28: IC_MAIN.9 42.5,37.74 v42.5,37.5
  Bottom 0.8: U$45.1 53.58,53.5 U$86.P$4
(copper drawn outside any net)
  shapes: Bottom area x1, Top area x4

### Text on the board
bDocu: (´・ω・`)
SKY: (´・ω・`) | Ver3.4